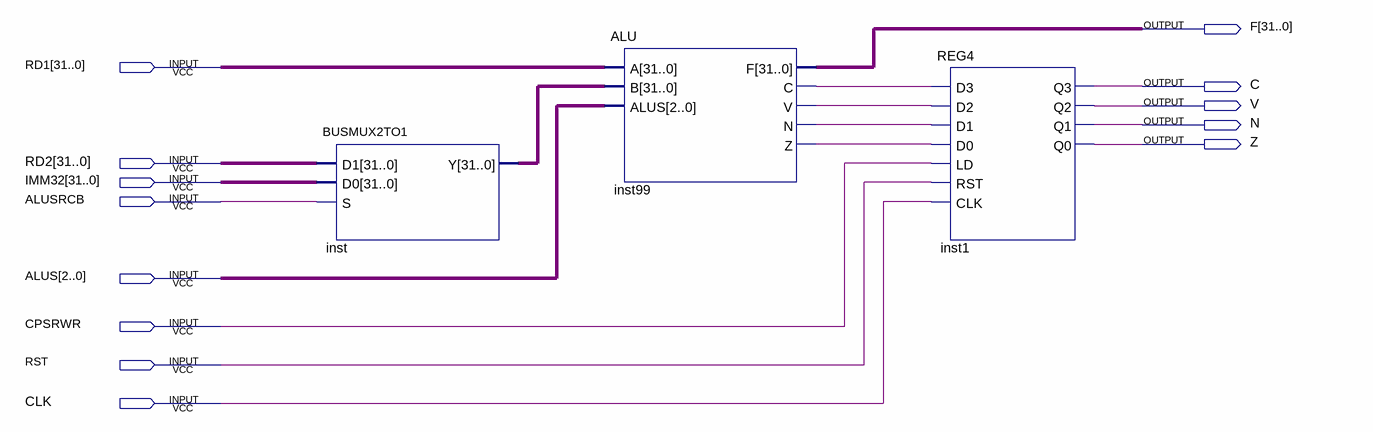
[diagram p0: schematic sheet]
// Quartus schematic execute.bdf as structural Verilog: 3 symbols, 13 pins
module execute (
  input  [31:0] RD1,
  input  [31:0] RD2,
  input  [31:0] IMM32,
  input  ALUSRCB,
  input  [2:0] ALUS,
  input  CPSRWR,
  input  RST,
  input  CLK,
  output [31:0] F,
  output C,
  output V,
  output N,
  output Z
);

  wire inst99_c, inst99_n, inst99_v, inst99_z;
  wire [31:0] inst_y;

  BUSMUX2TO1 inst (.D1(RD2), .D0(IMM32), .S(ALUSRCB), .Y(inst_y));
  ALU inst99 (.A(RD1), .B(inst_y), .ALUS(ALUS), .C(inst99_c), .V(inst99_v), .N(inst99_n), .Z(inst99_z), .F(F));
  REG4 inst1 (
    .D3(inst99_c), .D2(inst99_v), .D1(inst99_n), .D0(inst99_z), .LD(CPSRWR), .RST(RST), .CLK(CLK), .Q3(C),
    .Q2(V), .Q1(N), .Q0(Z));
endmodule
